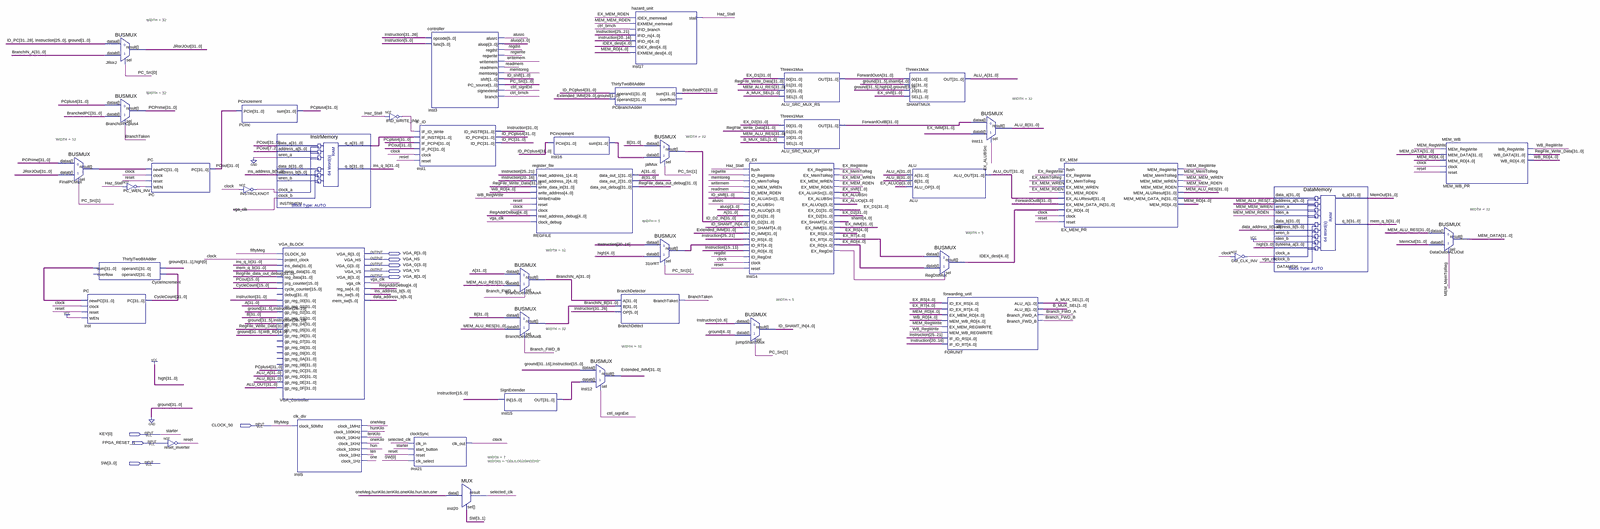
[diagram p0: schematic sheet, whole]
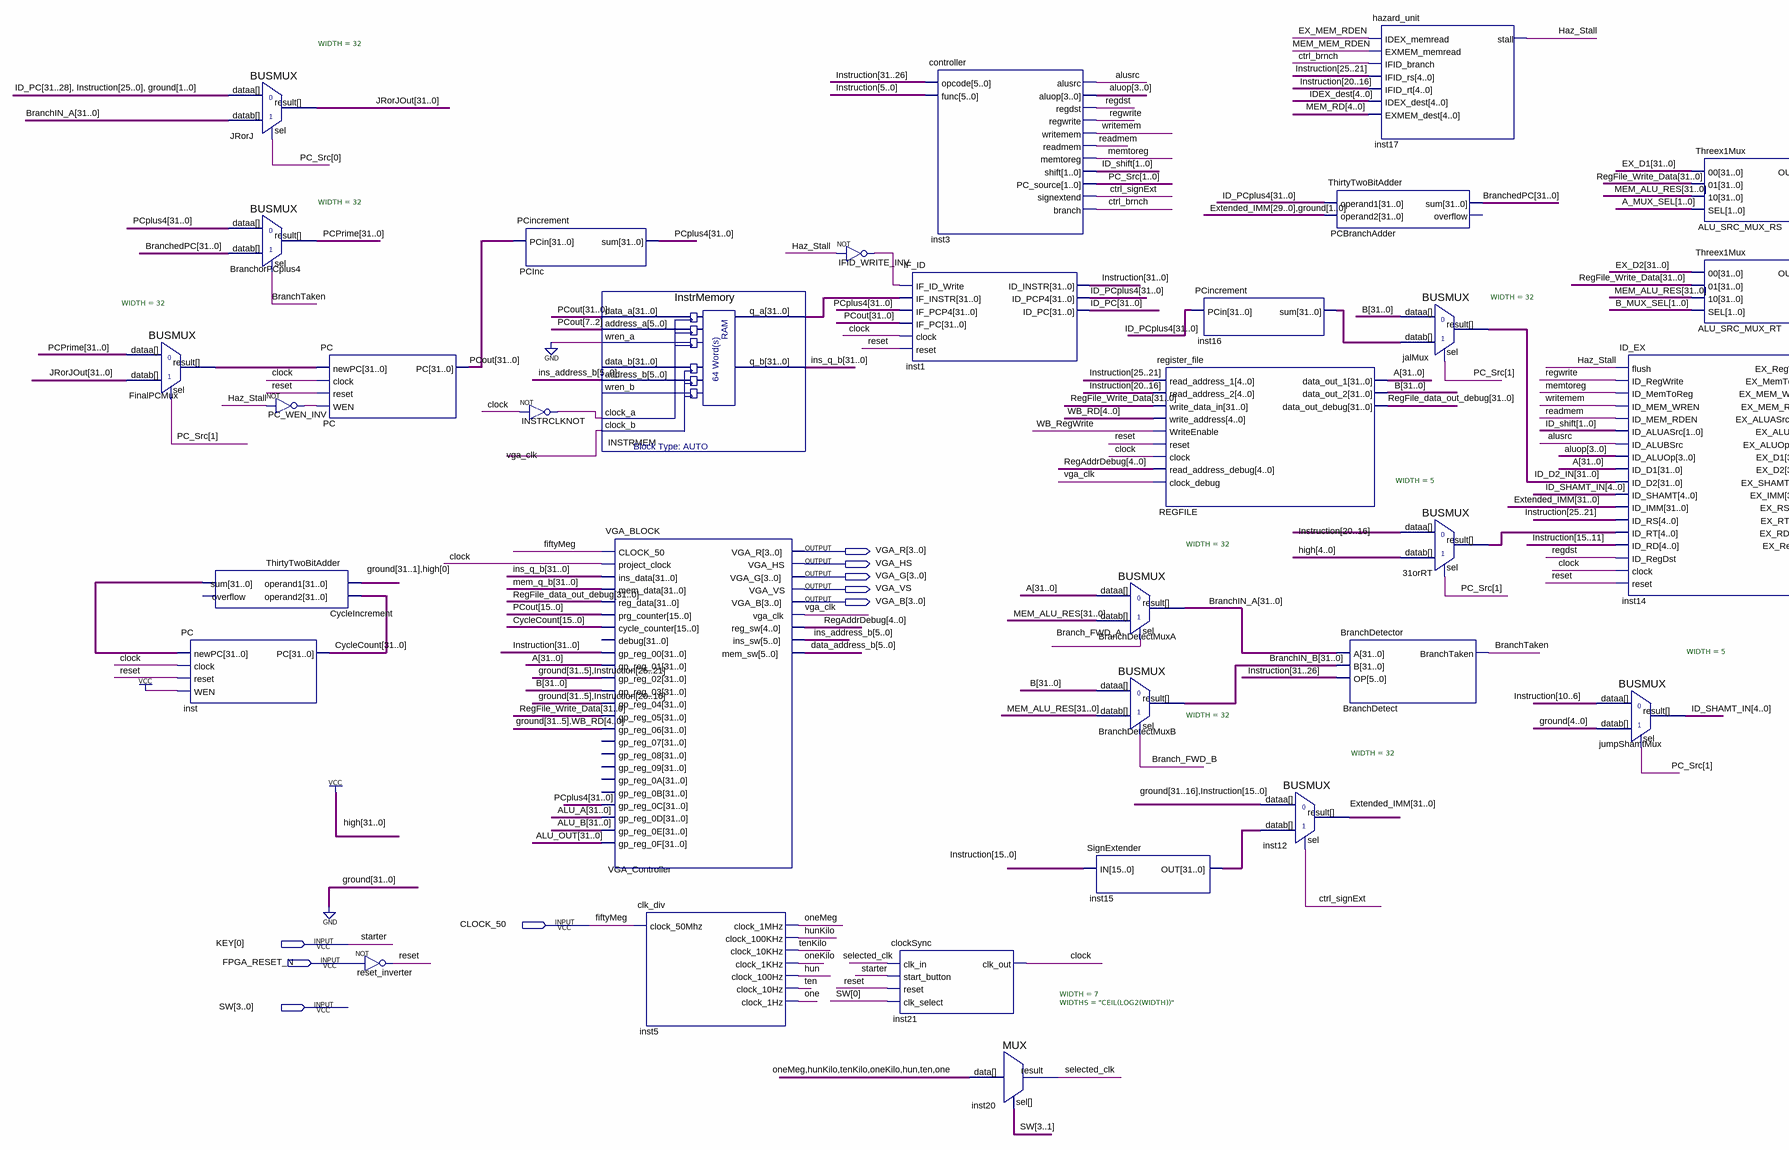
[diagram p1: schematic sheet, left part]
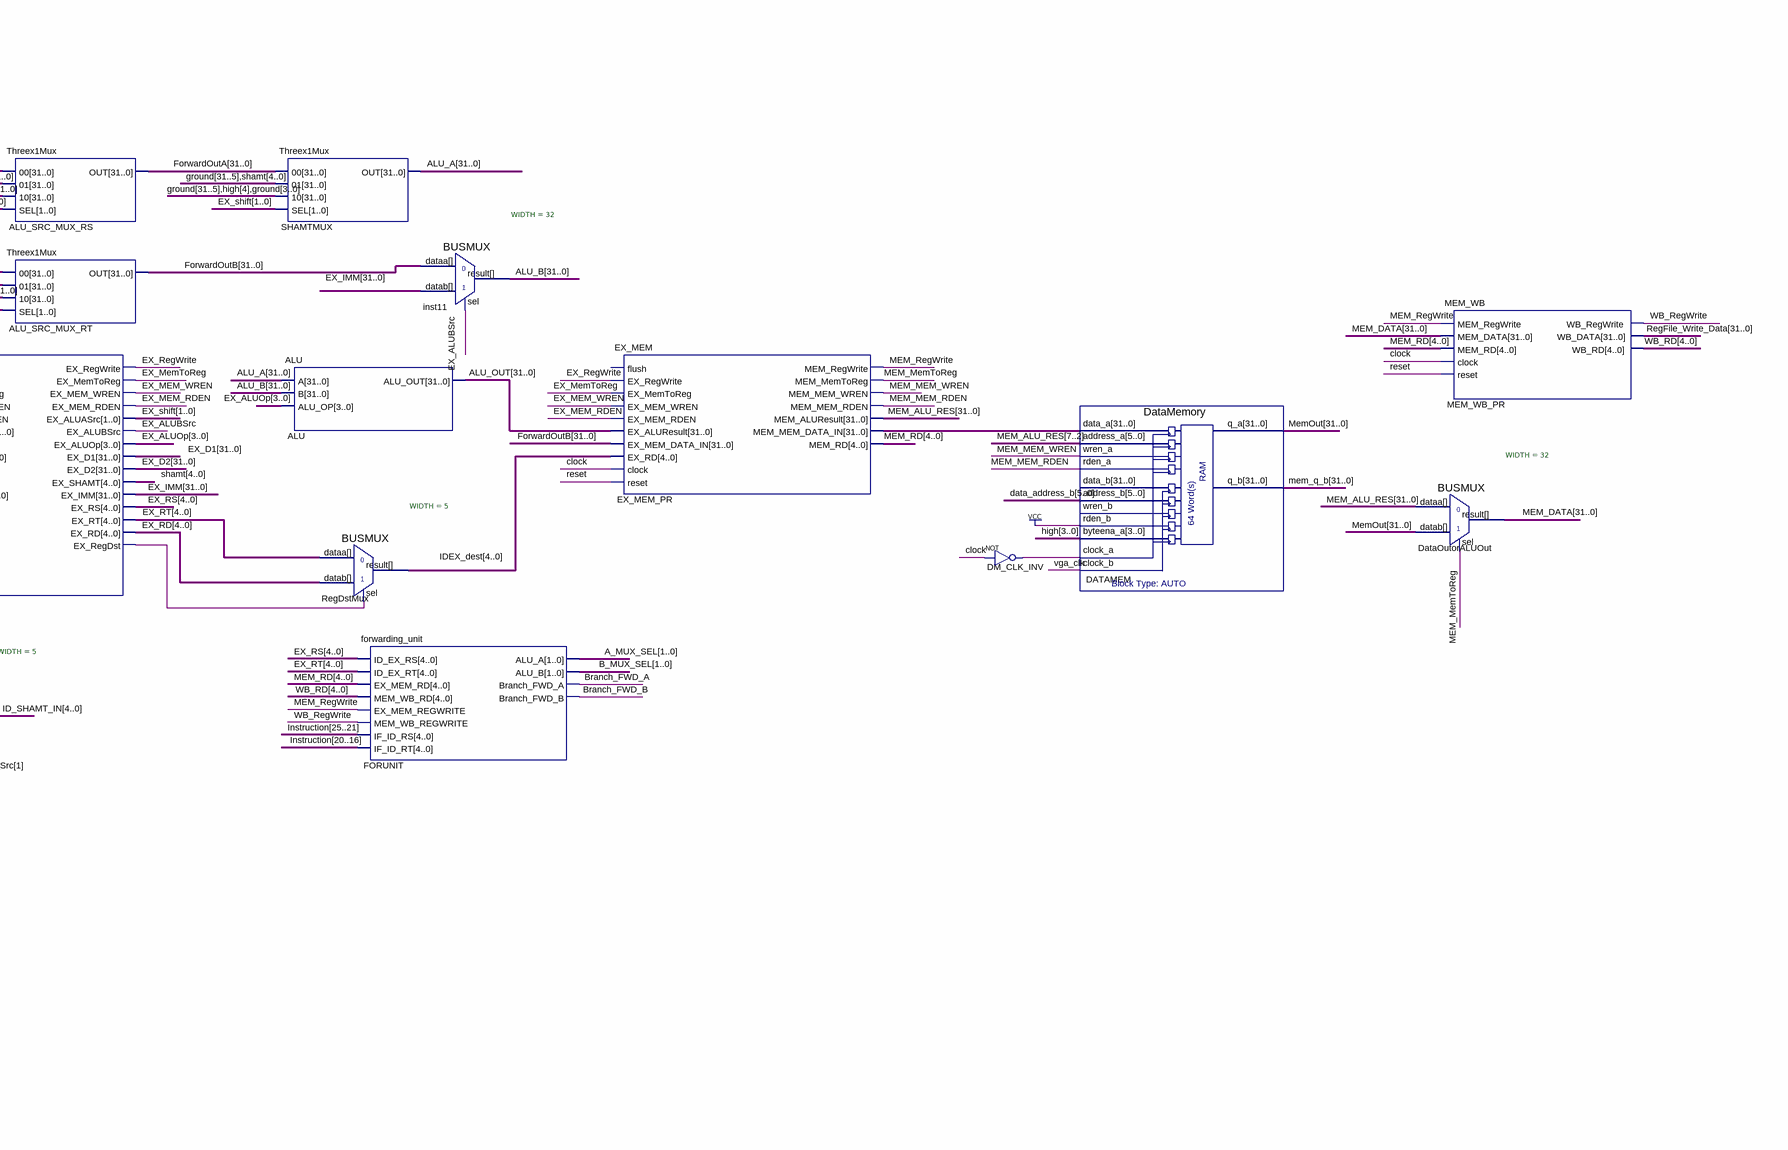
[diagram p2: schematic sheet, right part]
// Quartus schematic mips_cpu.bdf as structural Verilog: 43 symbols, 9 pins
module mips_cpu (
  input  CLOCK_50,
  input  [0:0] KEY,
  input  FPGA_RESET_N,
  input  [3:0] SW,
  output [3:0] VGA_R,
  output VGA_HS,
  output [3:0] VGA_G,
  output VGA_VS,
  output [3:0] VGA_B
);

  wire alusrc, Branch_FWD_A, Branch_FWD_B, BranchTaken, clock, ctrl_brnch, ctrl_signExt, DM_CLK_INV_out,
       EX_ALUBSrc, EX_MEM_RDEN, EX_MEM_WREN, EX_MemToReg, EX_RegWrite, Haz_Stall, hun, hunKilo,
       IFID_WRITE_INV_out, inst14_ex_regdst, INSTRCLKNOT_out, MEM_MEM_RDEN, MEM_MEM_WREN, MEM_MemToReg,
       MEM_RegWrite, memtoreg, one, oneKilo, oneMeg, PC_WEN_INV_out, readmem, regdst, regwrite, reset,
       selected_clk, ten, tenKilo, vga_clk, WB_RegWrite, writemem;
  wire [1:0] A_MUX_SEL, B_MUX_SEL, EX_shift, ID_shift, PC_Src;
  wire [3:0] aluop, EX_ALUOp;
  wire [4:0] EX_RD, EX_RS, EX_RT, ID_SHAMT_IN, IDEX_dest, MEM_RD, n31orRT_result, RegAddrDebug, shamt, WB_RD;
  wire [5:0] data_address_b, ins_address_b;
  wire [31:0] A, ALU_A, ALU_B, ALU_OUT, B, BranchedPC, BranchIN_A, BranchIN_B, CycleCount,
       CycleIncrement_sum, EX_D1, EX_D2, EX_IMM, EX_MEM_PR_mem_mem_data_in, Extended_IMM, FinalPCMux_result,
       ForwardOutA, ForwardOutB, ID_D2_IN, ID_PC, ID_PCplus4, ins_q_b, inst15_out, inst16_sum, INSTRMEM_q_a,
       Instruction, JRorJOut, MEM_ALU_RES, MEM_DATA, mem_q_b, MemOut, PCout, PCplus4, PCPrime,
       RegFile_data_out_debug, RegFile_Write_Data;

  BUSMUX #(.WIDTH(32)) FinalPCMux (.datab(JRorJOut), .sel(PC_Src[1]), .dataa(PCPrime), .result(FinalPCMux_result));
  ThirtyTwoBitAdder CycleIncrement (
    .operand1(32'b00000000000000000000000000000001), .operand2(CycleCount), .sum(CycleIncrement_sum));  // open: overflow
  PC inst (.newPC(CycleIncrement_sum), .clock(clock), .reset(reset), .WEN(1'b1), .PC(CycleCount));
  BUSMUX #(.WIDTH(32)) JRorJ (
    .datab(BranchIN_A), .sel(PC_Src[0]), .dataa({ID_PC[31:28], Instruction[25:0], 2'b00}), .result(JRorJOut));
  BUSMUX #(.WIDTH(32)) BranchorPCplus4 (.datab(BranchedPC), .sel(BranchTaken), .dataa(PCplus4), .result(PCPrime));
  not PC_WEN_INV (PC_WEN_INV_out, Haz_Stall);
  PC PC (.newPC(FinalPCMux_result), .clock(clock), .reset(reset), .WEN(PC_WEN_INV_out), .PC(PCout));
  not reset_inverter (reset, FPGA_RESET_N);
  PCincrement PCInc (.PCin(PCout), .sum(PCplus4));
  not INSTRCLKNOT (INSTRCLKNOT_out, clock);
  InstrMemory INSTRMEM (
    .data_a(PCout), .address_a(PCout[7:2]), .wren_a(1'b0), .address_b(ins_address_b),
    .clock_a(INSTRCLKNOT_out), .clock_b(vga_clk), .q_a(INSTRMEM_q_a), .q_b(ins_q_b));  // open: data_b, wren_b
  VGA_BLOCK VGA_Controller (
    .CLOCK_50(CLOCK_50), .project_clock(clock), .ins_data(ins_q_b), .mem_data(mem_q_b),
    .reg_data(RegFile_data_out_debug), .prg_counter(PCout[15:0]), .cycle_counter(CycleCount[15:0]),
    .gp_reg_00(Instruction), .gp_reg_01(A), .gp_reg_02({{27{1'b0}}, Instruction[25:21]}), .gp_reg_03(B),
    .gp_reg_04({{27{1'b0}}, Instruction[20:16]}), .gp_reg_05(RegFile_Write_Data),
    .gp_reg_06({{27{1'b0}}, WB_RD}), .gp_reg_0C(PCplus4), .gp_reg_0D(ALU_A), .gp_reg_0E(ALU_B),
    .gp_reg_0F(ALU_OUT), .VGA_R(VGA_R), .VGA_HS(VGA_HS), .VGA_G(VGA_G), .VGA_VS(VGA_VS), .VGA_B(VGA_B),
    .vga_clk(vga_clk), .reg_sw(RegAddrDebug), .ins_sw(ins_address_b), .mem_sw(data_address_b));  // open: debug, gp_reg_07, gp_reg_08, gp_reg_09, gp_reg_0A, gp_reg_0B
  clk_div inst5 (
    .clock_50Mhz(CLOCK_50), .clock_1MHz(oneMeg), .clock_100KHz(hunKilo), .clock_10KHz(tenKilo),
    .clock_1KHz(oneKilo), .clock_100Hz(hun), .clock_10Hz(ten), .clock_1Hz(one));
  not IFID_WRITE_INV (IFID_WRITE_INV_out, Haz_Stall);
  controller inst3 (
    .opcode(Instruction[31:26]), .func(Instruction[5:0]), .alusrc(alusrc), .aluop(aluop), .regdst(regdst),
    .regwrite(regwrite), .writemem(writemem), .readmem(readmem), .memtoreg(memtoreg), .shift(ID_shift),
    .PC_source(PC_Src), .signextend(ctrl_signExt), .branch(ctrl_brnch));
  IF_ID inst1 (
    .IF_ID_Write(IFID_WRITE_INV_out), .IF_INSTR(INSTRMEM_q_a), .IF_PCP4(PCplus4), .IF_PC(PCout),
    .clock(clock), .reset(reset), .ID_INSTR(Instruction), .ID_PCP4(ID_PCplus4), .ID_PC(ID_PC));
  clockSync inst21 (.clk_in(selected_clk), .start_button(KEY[0]), .reset(reset), .clk_select(SW[0]), .clk_out(clock));
  MUX #(.WIDTH(7), .WIDTHS("CEIL(LOG2(WIDTH))")) inst20 (
    .data({oneMeg, hunKilo, tenKilo, oneKilo, hun, ten, one}), .sel(SW[3:1]), .result(selected_clk));
  SignExtender inst15 (.IN(Instruction[15:0]), .OUT(inst15_out));
  BUSMUX #(.WIDTH(32)) BranchDetectMuxA (.datab(MEM_ALU_RES), .sel(Branch_FWD_A), .dataa(A), .result(BranchIN_A));
  BUSMUX #(.WIDTH(32)) BranchDetectMuxB (.datab(MEM_ALU_RES), .sel(Branch_FWD_B), .dataa(B), .result(BranchIN_B));
  register_file REGFILE (
    .read_address_1(Instruction[25:21]), .read_address_2(Instruction[20:16]),
    .write_data_in(RegFile_Write_Data), .write_address(WB_RD), .WriteEnable(WB_RegWrite), .reset(reset),
    .clock(clock), .read_address_debug(RegAddrDebug), .clock_debug(vga_clk), .data_out_1(A), .data_out_2(B),
    .data_out_debug(RegFile_data_out_debug));
  PCincrement inst16 (.PCin(ID_PCplus4), .sum(inst16_sum));
  BUSMUX #(.WIDTH(32)) inst12 (
    .datab(inst15_out), .sel(ctrl_signExt), .dataa({{16{1'b0}}, Instruction[15:0]}), .result(Extended_IMM));
  ThirtyTwoBitAdder PCBranchAdder (
    .operand1(ID_PCplus4), .operand2({Extended_IMM[29:0], 2'b00}), .sum(BranchedPC));  // open: overflow
  BranchDetector BranchDetect (.A(BranchIN_A), .B(BranchIN_B), .OP(Instruction[31:26]), .BranchTaken(BranchTaken));
  hazard_unit inst17 (
    .IDEX_memread(EX_MEM_RDEN), .EXMEM_memread(MEM_MEM_RDEN), .IFID_branch(ctrl_brnch),
    .IFID_rs(Instruction[25:21]), .IFID_rt(Instruction[20:16]), .IDEX_dest(IDEX_dest), .EXMEM_dest(MEM_RD),
    .stall(Haz_Stall));
  BUSMUX #(.WIDTH(32)) jalMux (.datab(inst16_sum), .sel(PC_Src[1]), .dataa(B), .result(ID_D2_IN));
  BUSMUX #(.WIDTH(5)) u_31orRT (
    .datab({5{1'b1}}), .sel(PC_Src[1]), .dataa(Instruction[20:16]), .result(n31orRT_result));
  ID_EX inst14 (
    .flush(Haz_Stall), .ID_RegWrite(regwrite), .ID_MemToReg(memtoreg), .ID_MEM_WREN(writemem),
    .ID_MEM_RDEN(readmem), .ID_ALUASrc(ID_shift), .ID_ALUBSrc(alusrc), .ID_ALUOp(aluop), .ID_D1(A),
    .ID_D2(ID_D2_IN), .ID_SHAMT(ID_SHAMT_IN), .ID_IMM(Extended_IMM), .ID_RS(Instruction[25:21]),
    .ID_RT(n31orRT_result), .ID_RD(Instruction[15:11]), .ID_RegDst(regdst), .clock(clock), .reset(reset),
    .EX_RegWrite(EX_RegWrite), .EX_MemToReg(EX_MemToReg), .EX_MEM_WREN(EX_MEM_WREN),
    .EX_MEM_RDEN(EX_MEM_RDEN), .EX_ALUASrc(EX_shift), .EX_ALUBSrc(EX_ALUBSrc), .EX_ALUOp(EX_ALUOp),
    .EX_D1(EX_D1), .EX_D2(EX_D2), .EX_SHAMT(shamt), .EX_IMM(EX_IMM), .EX_RS(EX_RS), .EX_RT(EX_RT),
    .EX_RD(EX_RD), .EX_RegDst(inst14_ex_regdst));
  BUSMUX #(.WIDTH(5)) jumpShamtMux (
    .datab({5{1'b0}}), .sel(PC_Src[1]), .dataa(Instruction[10:6]), .result(ID_SHAMT_IN));
  Threex1Mux ALU_SRC_MUX_RS (.SEL(A_MUX_SEL), .A(EX_D1), .B(RegFile_Write_Data), .C(MEM_ALU_RES), .OUT(ForwardOutA));
  Threex1Mux ALU_SRC_MUX_RT (.SEL(B_MUX_SEL), .A(EX_D2), .B(RegFile_Write_Data), .C(MEM_ALU_RES), .OUT(ForwardOutB));
  Threex1Mux SHAMTMUX (
    .SEL(EX_shift), .A(ForwardOutA), .B({{27{1'b0}}, shamt}), .C(32'b00000000000000000000000000010000),
    .OUT(ALU_A));
  ALU ALU (.A(ALU_A), .B(ALU_B), .ALU_OP(EX_ALUOp), .ALU_OUT(ALU_OUT));
  BUSMUX #(.WIDTH(5)) RegDstMux (.datab(EX_RD), .sel(inst14_ex_regdst), .dataa(EX_RT), .result(IDEX_dest));
  forwarding_unit FORUNIT (
    .ID_EX_RS(EX_RS), .ID_EX_RT(EX_RT), .EX_MEM_RD(MEM_RD), .MEM_WB_RD(WB_RD),
    .EX_MEM_REGWRITE(MEM_RegWrite), .MEM_WB_REGWRITE(WB_RegWrite), .IF_ID_RS(Instruction[25:21]),
    .IF_ID_RT(Instruction[20:16]), .ALU_A(A_MUX_SEL), .ALU_B(B_MUX_SEL), .Branch_FWD_A(Branch_FWD_A),
    .Branch_FWD_B(Branch_FWD_B));
  BUSMUX #(.WIDTH(32)) inst11 (.datab(EX_IMM), .sel(EX_ALUBSrc), .dataa(ForwardOutB), .result(ALU_B));
  EX_MEM EX_MEM_PR (
    .EX_RegWrite(EX_RegWrite), .EX_MemToReg(EX_MemToReg), .EX_MEM_WREN(EX_MEM_WREN),
    .EX_MEM_RDEN(EX_MEM_RDEN), .EX_ALUResult(ALU_OUT), .EX_MEM_DATA_IN(ForwardOutB), .EX_RD(IDEX_dest),
    .clock(clock), .reset(reset), .MEM_RegWrite(MEM_RegWrite), .MEM_MemToReg(MEM_MemToReg),
    .MEM_MEM_WREN(MEM_MEM_WREN), .MEM_MEM_RDEN(MEM_MEM_RDEN), .MEM_ALUResult(MEM_ALU_RES),
    .MEM_MEM_DATA_IN(EX_MEM_PR_mem_mem_data_in), .MEM_RD(MEM_RD));  // open: flush
  not DM_CLK_INV (DM_CLK_INV_out, clock);
  DataMemory DATAMEM (
    .data_a(EX_MEM_PR_mem_mem_data_in), .address_a(MEM_ALU_RES[7:2]), .wren_a(MEM_MEM_WREN),
    .rden_a(MEM_MEM_RDEN), .address_b(data_address_b), .rden_b(1'b1), .byteena_a(4'b1111),
    .clock_a(DM_CLK_INV_out), .clock_b(vga_clk), .q_a(MemOut), .q_b(mem_q_b));  // open: data_b, wren_b
  BUSMUX #(.WIDTH(32)) DataOutorALUOut (.datab(MemOut), .sel(MEM_MemToReg), .dataa(MEM_ALU_RES), .result(MEM_DATA));
  MEM_WB MEM_WB_PR (
    .MEM_RegWrite(MEM_RegWrite), .MEM_DATA(MEM_DATA), .MEM_RD(MEM_RD), .clock(clock), .reset(reset),
    .WB_RegWrite(WB_RegWrite), .WB_DATA(RegFile_Write_Data), .WB_RD(WB_RD));

  // Other names for the same wires on the sheet: fiftyMeg = CLOCK_50; starter = KEY[0]
endmodule
